# Altium schematic sheet MOTOR.SchDoc: ROBOX V2 - Motor Controller
size A4; DrawnBy: Jan Stappers; Engineer: Jan Stappers; DocumentNumber: JSP016; Revision: B; SheetNumber: 5; SheetTotal: 6
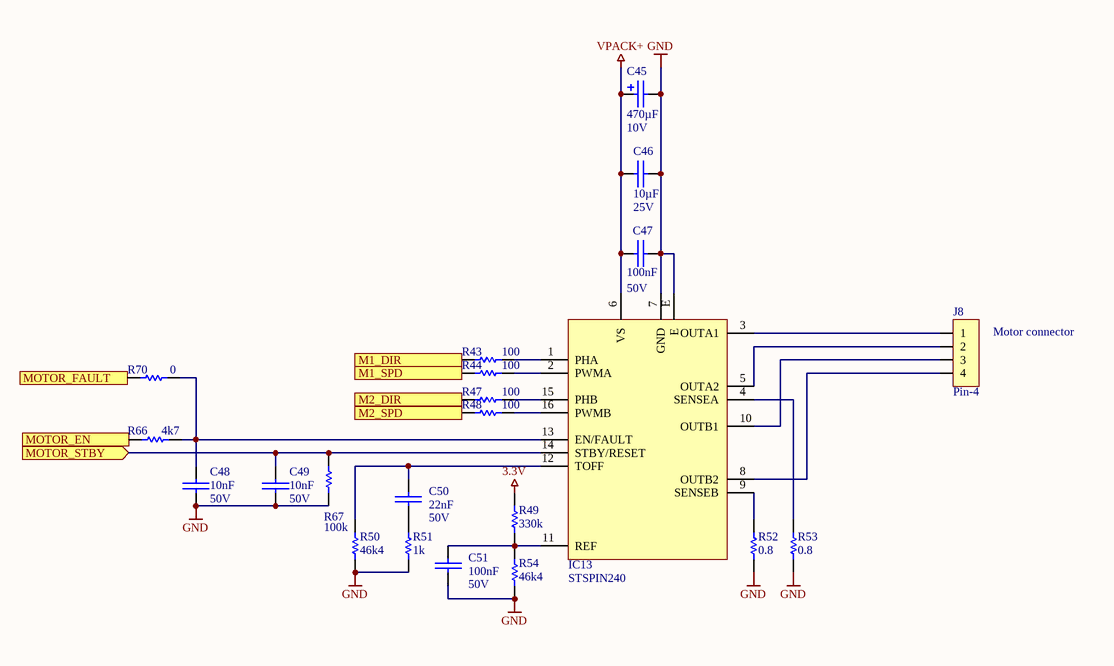
[diagram p0: MOTOR.SchDoc]

## Parts
C45  value 470µF  voltage: 10V  [CD6.3H12TH]  (hidden comment: cap-pol)
C46  value 10µF  voltage: 25V  [C0603]  (hidden comment: cap_non_pol)
C47  value 100nF  voltage: 50V  [C0402]  (hidden comment: cap_non_pol)
C48  value 10nF  voltage: 50V  [C0402]  (hidden comment: cap_non_pol)
C49  value 10nF  voltage: 50V  [C0402]  (hidden comment: cap_non_pol)
C50  value 22nF  voltage: 50V  [C0402]  (hidden comment: cap_non_pol)
C51  value 100nF  voltage: 50V  [TH5.08]  (hidden comment: cap_non_pol)
IC13  STSPIN240  [VFQFPN-16]
J8  Pin-4  [110990030]
R43  value 100  [R0402]  (hidden comment: resistor)
R44  value 100  [R0402]  (hidden comment: resistor)
R47  value 100  [R0402]  (hidden comment: resistor)
R48  value 100  [R0402]  (hidden comment: resistor)
R49  value 330k  [R0402]  (hidden comment: resistor)
R50  value 46k4  [R0402]  (hidden comment: resistor)
R51  value 1k  [R0402]  (hidden comment: resistor)
R52  value 0.8  [R1206]  (hidden comment: resistor)
R53  value 0.8  [R1206]  (hidden comment: resistor)
R54  value 46k4  [R0402]  (hidden comment: resistor)
R66  value 4k7  [R0402]  (hidden comment: resistor)
R67  value 100k  [R0402]  (hidden comment: resistor)
R70  value 0  [R0402]  (hidden comment: resistor)

## Ports
M1_DIR (in), M1_SPD (in), M2_DIR (in), M2_SPD (in), MOTOR_EN (in), MOTOR_FAULT (out), MOTOR_STBY (in)

## Nets
3.3V: R49.1
GND: C45.- C46.2 C47.1 C48.2 C49.2 C51.1 IC13.7(GND) IC13.E R50.2 R51.1 R52.1 R53.1 R54.2 R67.2
VPACK+: C45.+ C46.1 C47.2 IC13.6(VS)
M1_DIR: R43.2 ; port M1_DIR
M1_SPD: R44.2 ; port M1_SPD
M2_DIR: R47.2 ; port M2_DIR
M2_SPD: R48.2 ; port M2_SPD
MOTOR_EN: R66.2 ; port MOTOR_EN
MOTOR_FAULT: R70.2 ; port MOTOR_FAULT
MOTOR_STBY: C49.1 IC13.14(STBY/RESET) R67.1 ; port MOTOR_STBY
NetC48_1: C48.1 IC13.13(EN/FAULT) R66.1 R70.1
NetC50_1: C50.1 R51.2
NetC50_2: C50.2 IC13.12(TOFF) R50.1
NetC51_2: C51.2 IC13.11(REF) R49.2 R54.1
NetIC13_1: IC13.1(PHA) R43.1
NetIC13_2: IC13.2(PWMA) R44.1
NetIC13_3: IC13.3(OUTA1) J8.1
NetIC13_4: IC13.4(SENSEA) R53.2
NetIC13_5: IC13.5(OUTA2) J8.2
NetIC13_8: IC13.8(OUTB2) J8.4
NetIC13_9: IC13.9(SENSEB) R52.2
NetIC13_10: IC13.10(OUTB1) J8.3
NetIC13_15: IC13.15(PHB) R47.1
NetIC13_16: IC13.16(PWMB) R48.1

## Notes on the sheet
- (near J8) Motor connector
- Title
- Size:
- Date:
- A4
- Number:
- Time:
- Revision:
- Sheet
- of
- File:

## Library data of the parts
C45 = 4: CAP ALUM 470UF 20% 10V TH; manufacturer_ref: EGH1AM471E12OT; manufacturer: AISHI(Aihua Group); id: 4; dielectric: Aluminium; tolerance: 20%; package: d6.3h12TH; supplier_1: lcsc; supplier_1_partnumber: C2924460; price: 0,0391; status: active
C46 = 1: CAP CER 10UF 25V X5R 10% SMD; manufacturer_ref: GRM188R61E106KA73D; manufacturer: Murata Electronics; id: 1; tolerance: 10%; dielectric: X5R; package: 0603; supplier_1: digikey; supplier_1_partnumber: 490-18214-1-ND; price: 0,06969; status: active
C47 = 0: CAP CER 0.1UF 50V X5R 0402; manufacturer_ref: 490-16356-1-ND; manufacturer: Murata Electronics; id: 0; tolerance: 5%; dielectric: X5R; package: 0402; supplier_1: digikey; supplier_1_partnumber: 490-16356-1-ND; price: 0,00933; status: non stock
C48 C49 = 7: CAP CER 10000PF 50V X7R 0402; manufacturer_ref: CL05B103KB5NNNC; manufacturer: Samsung Electro-Mechanics; id: 7; tolerance: 10%; dielectric: X7R; package: 0402; supplier_1: digikey; supplier_1_partnumber: 1276-1028-1-ND; price: 0,00333; status: active
C50 = 53: CAP CER 0.022UF 50V X7R 0402; manufacturer_ref: GRM155R71H223KA12D; manufacturer: Murata Electronics; id: 53; tolerance: 10%; dielectric: X7R; package: 0402; supplier_1: digikey; supplier_1_partnumber: 490-3884-1-ND; price: 0,09; status: active
C51 = 51: CAP CER TH 100nF X7R 50V; manufacturer_ref: C2761753; manufacturer: FH; id: 51; tolerance: 10%; dielectric: X7R; package: TH5.08; supplier_1: lcsc; supplier_1_partnumber: C385200; price: 0,0237; status: active
IC13 = 81: IC HALF BRIDGE DRV 1.3A 16VFQFPN; manufacturer: STMicroelectronics; id: 81; manufacturer_ref: STSPIN240; type: MISC (Motor Driver); package: 16-VFQFPN; supplier_1: digikey; supplier_1_partnumber: 497-16604-1-ND; status: active
J8 = 58: GROVE 2MM 4PIN VERT CONN 10PCS; manufacturer: Seeed Technology Co., Ltd; id: 58; nbr_positions_total: 4; manufacturer_ref: 110990030; package: Pin-4SR; supplier_1: digikey; supplier_1_partnumber: 1597-1082-ND; price: 0,157; status: active
R43 R44 R47 R48 = 29: RES SMD 100 OHM 1% 1/5W 0402; manufacturer_ref: CRCW0402100RFKEDHP; manufacturer: Vishay Dale; id: 29; tolerance: 1%; power: 1/5W; package: 0402; supplier_1: digikey; supplier_1_partnumber: 541-100YCT-ND; price: 0,01933; status: active
R49 = 65: RES 330K OHM 1% 1/16W 0402; manufacturer_ref: RC0402FR-13330KL; manufacturer: YAGEO; id: 65; tolerance: 1%; power: 1/16W; package: 0402; supplier_1: digikey; supplier_1_partnumber: 13-RC0402FR-13330KLCT-ND; price: 0,013; status: active
R50 R54 = 39: RES SMD 46.4K OHM 1% 1/16W 0402; manufacturer_ref: AC0402FR-0746K4L; manufacturer: Yageo; id: 39; tolerance: 1%; power: 1/16W; package: 0402; supplier_1: digikey; supplier_1_partnumber: 13-AC0402FR-0746K4LCT-ND; price: 0,00296; status: active
R51 = 0: RES SMD 1K OHM 1% 1/10W 0402; manufacturer_ref: ERJ-2RKF1001X; manufacturer: Panasonic Electronic Components; id: 0; tolerance: 1%; power: 1/10W; package: 0402; supplier_1: digikey; supplier_1_partnumber: P1.00KLCT-ND; price: 0,00855; status: active
R52 R53 = 92: RES 0.002 OHM 1% 1W 1206; manufacturer_ref: D1MPC1206DR002FF-T5; manufacturer: Thin Film Technology Corp.; id: 92; tolerance: 1%; power: 1W; package: 1206; supplier_1: digikey; supplier_1_partnumber: 4463-D1MPC1206DR002FF-T5TR-ND; price: 0,33; status: active
R66 = 1: RES SMD 4.7K OHM 1% 1/10W 0402; manufacturer_ref: ERJ-2RKF4701X; manufacturer: Panasonic Electronic Components; id: 1; tolerance: 1%; power: 1/10W; package: 0402; supplier_1: digikey; supplier_1_partnumber: P4.70KLCT-ND; price: 0,00901; status: active
R67 = 7: RES SMD 100K OHM 1% 1/10W 0402; manufacturer_ref: ERJ-2RKF1003X; manufacturer: Panasonic Electronic Components; id: 7; tolerance: 1%; power: 1/10W; package: 0402; supplier_1: digikey; supplier_1_partnumber: P100KLCT-ND; price: 0,00735; status: active
R70 = 8: RES SMD 0 OHM JUMPER 1/10W 0402; manufacturer_ref: ERJ-2GE0R00X; manufacturer: Panasonic Electronic Components; id: 8; tolerance: 1%; power: 1/10W; package: 0402; supplier_1: digikey; supplier_1_partnumber: P0.0JCT-ND; price: 0,00487; status: active